# Altium schematic sheet PSU.SchDoc
size A4
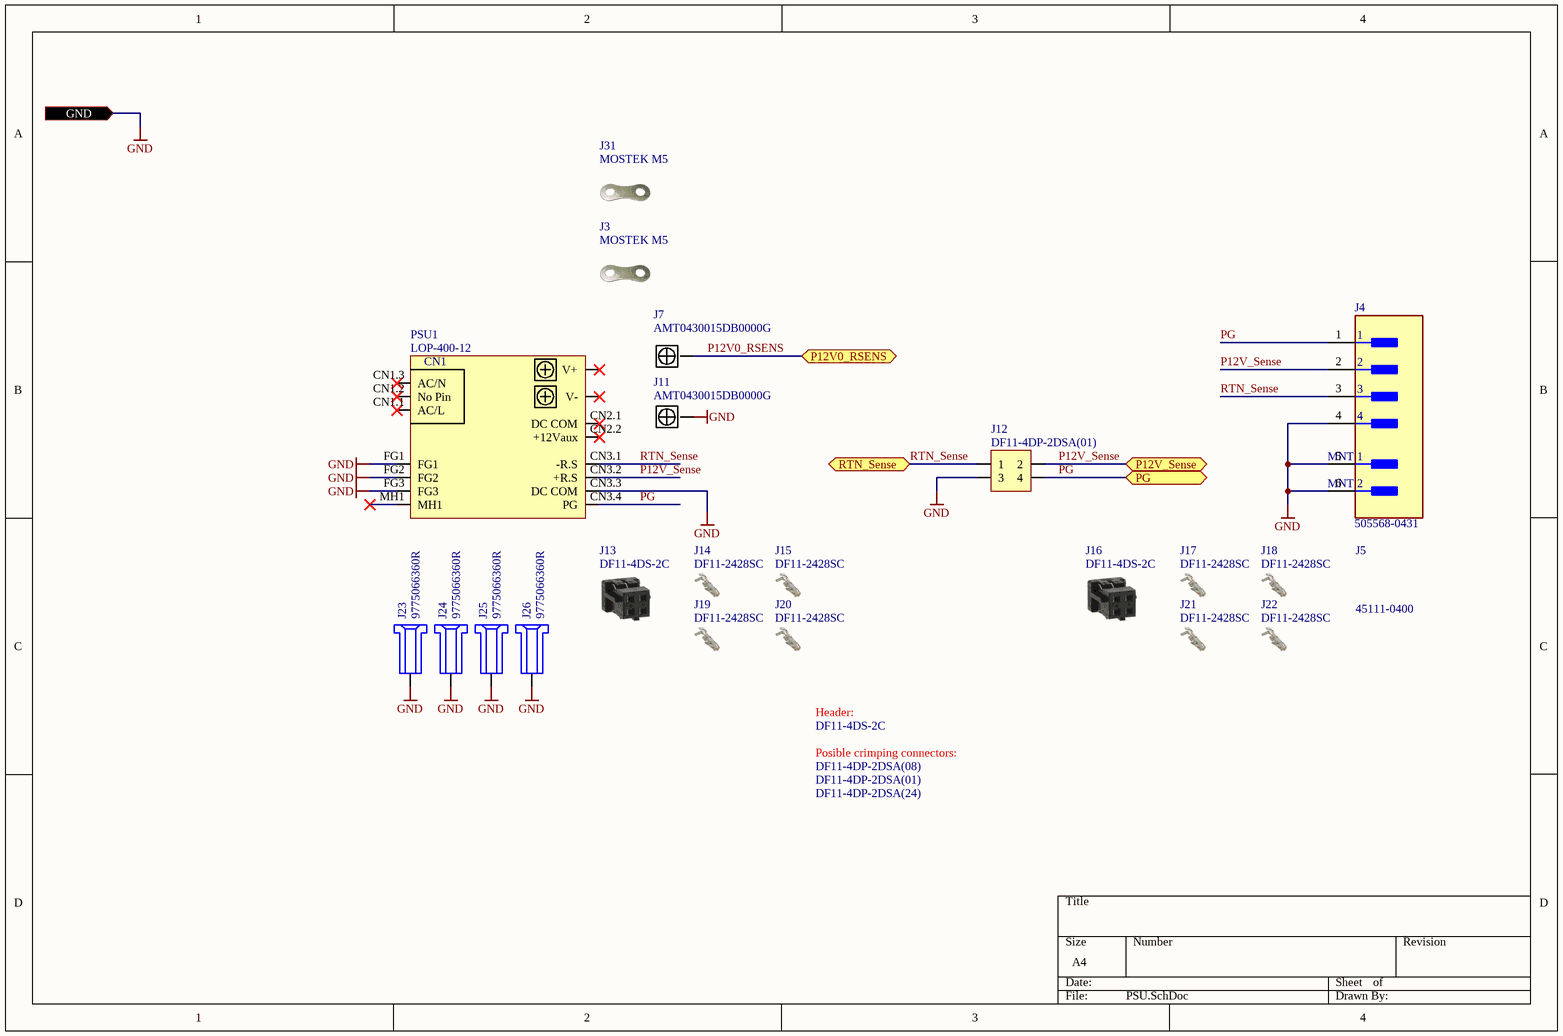
[diagram p0: PSU.SchDoc]

## Parts
J3  MOSTEK M5
J4  505568-0431  [FP-505568-0431-MFG]
J5  45111-0400  [45111-0400]  (mechanical)
J7  AMT0430015DB0000G  [AMT0430015DB0000G]
J11  AMT0430015DB0000G  [AMT0430015DB0000G]
J12  DF11-4DP-2DSA(01)  [DF11-4DP-2DSA(01)]
J13  DF11-4DS-2C  [DF11-4DS-2C]
J14  DF11-2428SC
J15  DF11-2428SC
J16  DF11-4DS-2C  [DF11-4DS-2C]
J17  DF11-2428SC
J18  DF11-2428SC
J19  DF11-2428SC
J20  DF11-2428SC
J21  DF11-2428SC
J22  DF11-2428SC
J23  9775066360R  [9775066360R]
J24  9775066360R  [9775066360R]
J25  9775066360R  [9775066360R]
J26  9775066360R  [9775066360R]
J31  MOSTEK M5
PSU1  LOP-400  [LOP-400-12]  (value not drawn)

## Ports
GND (in), P12V0_RSENS (bidir), P12V_Sense (bidir), PG (bidir), RTN_Sense (bidir)

## Nets
GND: J4.4 J4.5(MNT_1) J4.6(MNT_2) J11.1 J12.3 J23.1 J24.1 J25.1 J26.1 PSU1.CN3.3(DC_COM) PSU1.FG1 PSU1.FG2 PSU1.FG3 ; port GND
P12V0_RSENS: J7.1 ; port P12V0_RSENS
P12V_Sense: J4.2 J12.2 PSU1.CN3.2(+R.S) ; port P12V_Sense
PG: J4.1 J12.4 PSU1.CN3.4(PG) ; port PG
RTN_Sense: J4.3 J12.1 PSU1.CN3.1(-R.S) ; port RTN_Sense

Not connected (* = marked no-connect by the designer): PSU1 CN1.1(AC/L)* CN1.2(No_Pin)* CN1.3(AC/N)* CN2.1(DC_COM)* CN2.2(+12Vaux)* MH1* V+* V-*

## Notes on the sheet
- Header:
- DF11-4DP-2DSA(08)
- DF11-4DP-2DSA(01)
- DF11-4DS-2C
- Posible crimping connectors:
- DF11-4DP-2DSA(24)
- (in symbol LOP-400-12) CN1

## Library data of the parts
J3 J31 = Mostek M5: Mostek do tabliczki zaciskowej M5; PressFit: No; Part Number: MOSTEK M5; Component Kind: Standard; Component Type: Standard; Footprint: MOSTEK M5; Pin Count: 1; Family: VH; Mounted: Yes; Socket: No; SMD: No; Sense: No; Status: None; Part Description: Mostek do tabliczki zaciskowej M5; Manufacturer: N/A; Manufacturer Part Number: MOSTEK M5; HelpURL: https://sklepelsat2.pl/mostek-do-tabliczki-zaciskowej-m5,132,1204.html; Author: LPA; CreateDate: 09.02.2025; LatestRevisionDate: 09.02.2025
J4 = CMP-002-04657-2: Connector Wire to Board Micro-Lock Plug 4 Position 1.25mm Straight Surface Mount Black
J5 = CMP-112-000242-2: Molex 45111-0400 Rectangular Cable Assemblies Micro-Lock Plus 04P Ots Assembly,
J7 J11 = AMT0430015DB0000G: 4 Pin Screw Terminal, Power Tap M3 Through Hole; Manufacturer: Amphenol Anytek; PressFit: No; Part Number: AMT0430015DB0000G; Component Kind: Standard; Component Type: Standard; Pin Count: 4; Family: LOP-400; Mounted: Yes; Socket: No; SMD: No; Sense: No; Status: None; Part Description: 4 Pin Screw Terminal, Power Tap M3 Through Hole; Manufacturer Part Number: AMT0430015DB0000G; ComponentHeight: 12mm; HelpURL: https://www.anytek.com.cn/Upload/AMT43015DB-ed7a3ffa30954f7d99d4bb13dc927db5.pdf; Author: LPA; CreateDate: 09.02.2025; LatestRevisionDate: 09.02.2025
J12 = DF11-4DP-2DSA(01): Part Description: Connector Header Through Hole 4 position 0.079" (2.00mm); Manufacturer: Hirose Electric Co Ltd; PressFit: No; Part Number: DF11-4DP-2DSA(01); Component Kind: Standard; Component Type: Standard; Pin Count: 1; Family: DF11; Mounted: Yes; Socket: No; SMD: No; Sense: No; Status: None; Manufacturer Part Number: DF11-4DP-2DSA(01); ComponentHeight: 6.6mm; HelpURL: https://www.hirose.com/de/product/document?clcode=&productname=&series=DF11&documenttype=Catalog&lang=en&documentid=en_DF11_CAT; Author: LPA; CreateDate: 09.02.2025; LatestRevisionDate: 09.02.2025
J13 J16 = DF11-4DS-2C: 4 Rectangular Connectors - Housings Receptacle Black 0.079" (2.00mm); Manufacturer: Hirose Electric Co Ltd; PressFit: No; Part Number: DF11-4DS-2C; Component Kind: Standard; Component Type: Standard; Pin Count: 1; Family: DF11; Mounted: Yes; Socket: No; SMD: No; Sense: No; Status: None; Part Description: 4 Rectangular Connectors - Housings Receptacle Black 0.079" (2.00mm); Manufacturer Part Number: DF11-4DS-2C; ComponentHeight: 7.3mm; HelpURL: https://www.hirose.com/de/product/document?clcode=&productname=&series=DF11&documenttype=Catalog&lang=en&documentid=en_DF11_CAT; Author: LPA; CreateDate: 09.02.2025; LatestRevisionDate: 09.02.2025
J14 J15 J17-J22 = DF11-2428SC: Socket Contact Tin 24-28 AWG Crimp; Manufacturer: Hirose Electric Co Ltd; PressFit: No; Part Number: DF11-2428SC; Component Kind: Socket Contact; Component Type: Socket Contact; Footprint: DF11-2428SC; Pin Count: 1; Family: DF11; Mounted: Yes; Socket: No; SMD: No; Sense: No; Status: None; Part Description: Socket Contact Tin 24-28 AWG Crimp; Manufacturer Part Number: DF11-2428SC; ComponentHeight: N/A; HelpURL: https://www.hirose.com/product/download/?distributor=digikey&type=specSheet&lang=en&num=DF11-2428SC; Author: LPA; CreateDate: 09.02.2025; LatestRevisionDate: 09.02.2025
J23-J26 = 9775066360R: Round Standoff Threaded M3 Steel 0.039" (1.00mm); Manufacturer: Würth Elektronik; PressFit: No; Part Number: 9775066360R; Component Kind: Standard; Component Type: Standard; Pin Count: 1; Family: WA-SMSR; Mounted: Yes; Socket: No; SMD: No; Sense: No; Status: None; Part Description: Round Standoff Threaded M3 Steel 0.039" (1.00mm); Manufacturer Part Number: 9775066360R; ComponentHeight: 6.6mm; HelpURL: https://www.we-online.com/en/components/products/SMSR_SMD_STEEL_SPACER_M3_THREAD_INTERNAL#9775066360R; Author: LPA; CreateDate: 09.02.2025; LatestRevisionDate: 09.02.2025
PSU1 = LOP-400-12: AC-DC low profile open frame power supply; 150% peak for 3s; 250W convection and 400W fan cooling; input 80~264Vac; output 12Vdc; wide operating temperature range -40°~+80°C; aux 12V/0.5A for external fan; industrial EN/UL62368-1, household EN/UL60335-1 and medical EN/UL60601-1 multi-field certification; suitable for class I and class II applications; Part Description: Right Angle PowerBlade Power Connector 3ACP + 2P + 24S + 4P Contacts; Manufacturer: MEANWELL; PressFit: No; Part Number: LOP-400-12; Component Kind: Standard; Component Type: Standard; Pin Count: 11; Family: LOP-400; Mounted: Yes; Socket: No; SMD: No; Sense: No; Status: None; Manufacturer Part Number: LOP-400-12; ComponentHeight: 27.5±1mm; HelpURL: https://www.meanwell.com/webapp/product/search.aspx?prod=LOP-400; Author: LPA; CreateDate: 08.02.2025; LatestRevisionDate: 08.02.2025